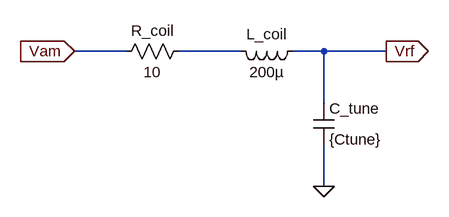
[diagram p0: schematic antenna.asc]
antenna.asc, the LTspice schematic file:
Version 4.1
SHEET 1 880 680
WIRE 80 112 0 112
WIRE 256 112 160 112
WIRE 384 112 336 112
WIRE 480 112 384 112
WIRE 384 192 384 112
WIRE 384 320 384 256
FLAG 384 320 0
FLAG 0 112 Vam
IOPIN 0 112 In
FLAG 480 112 Vrf
IOPIN 480 112 Out
SYMBOL res 176 96 R90
WINDOW 0 0 56 VBottom 2
WINDOW 3 32 56 VTop 2
SYMATTR InstName R_coil
SYMATTR Value 10
SYMBOL ind 352 96 R90
WINDOW 0 5 56 VBottom 2
WINDOW 3 32 56 VTop 2
SYMATTR InstName L_coil
SYMATTR Value 200µ
SYMATTR SpiceLine Rser=1m
SYMBOL cap 368 192 R0
SYMATTR InstName C_tune
SYMATTR Value {Ctune}

The netlist it stands for:
* antenna.asc
R_coil N001 Vam 10
L_coil Vrf N001 200µ Rser=1m
C_tune Vrf 0 {Ctune}
.backanno
.end